# Altium schematic sheet Sheet1.SchDoc
size A
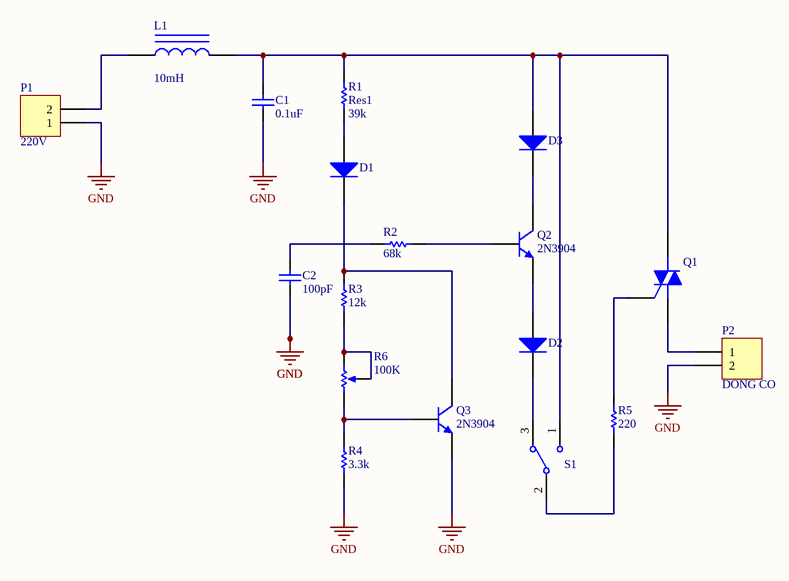
[diagram p0: Sheet1.SchDoc]

## Parts
C1  value 0.1uF  [CAPR2.54-5.1x3.2]  (hidden comment: Cap)
C2  value 100pF  [CAPR2.54-5.1x3.2]  (hidden comment: Cap)
D1  Diode  [AXIAL-0.3]  (value not drawn)
D2  Diode  [AXIAL-0.3]  (value not drawn)
D3  Diode  [AXIAL-0.3]  (value not drawn)
L1  value 10mH  [AXIAL-0.9]  (hidden comment: Inductor Iron)
P1  220V  [HDR1X2]
P2  DONG CO  [HDR1X2]
Q1  Triac  [SFM-T3/A2.4V]  (value not drawn)
Q2  2N3904  [SFM-T3/X1.6V]
Q3  2N3904  [SFM-T3/X1.6V]
R1  Res1  value 39k  [AXIAL-0.3]
R2  value 68k  [AXIAL-0.3]  (hidden comment: Res1)
R3  value 12k  [AXIAL-0.3]  (hidden comment: Res1)
R4  value 3.3k  [AXIAL-0.3]  (hidden comment: Res1)
R5  value 220  [AXIAL-0.3]  (hidden comment: Res1)
R6  value 100K  [VR5]  (hidden comment: RPot)
S1  SW-SPDT  [TL36WW15050]  (value not drawn)

## Nets
GND: C1.1 C2.1 P1.1 P2.2 Q3.1(E) R4.1
NetC1_2: C1.2 D3.1(A) L1.2 Q1.2(M2) R1.2 S1.1
NetC2_2: C2.2 R2.1
NetD1_1: D1.1(A) R1.1
NetD1_2: D1.2(K) Q3.3(C) R3.2
NetD2_1: D2.1(A) Q2.1(E)
NetD2_2: D2.2(K) S1.3
NetD3_2: D3.2(K) Q2.3(C)
NetL1_1: L1.1 P1.2
NetP2_1: P2.1 Q1.1(M1)
NetQ1_3: Q1.3(G) R5.2
NetQ2_2: Q2.2(B) R2.2
NetQ3_2: Q3.2(B) R4.2 R6.1(TOP)
NetR3_1: R3.1 R6.2(BOT) R6.3(TAP)
NetR5_1: R5.1 S1.2

## Library data of the parts
C1 C2 = Cap: Capacitor; Published: 8-Jun-2000; LatestRevisionDate: 17-Jul-2002; LatestRevisionNote: Re-released for DXP Platform.; PackageReference: RAD-0.3; Publisher: Altium Limited
D1-D3 = Diode: Default Diode; Published: 8-Jun-2000; LatestRevisionDate: 17-Jul-2002; LatestRevisionNote: Re-released for DXP Platform.; PackageVersion: Sep-1996; PackageReference: SMC; Publisher: Altium Limited; Code_JEDEC: DO-214-AB
L1 = Inductor Iron: Magnetic-Core Inductor; Published: 24-Mar-1999; LatestRevisionDate: 17-Jul-2002; LatestRevisionNote: Re-released for DXP Platform.; PackageReference: AXIAL-0.9; Publisher: Altium Limited
P1 P2 = Header 2: Header, 2-Pin; LatestRevisionDate: 17-Jul-2002; LatestRevisionNote: Re-released for DXP Platform.; Publisher: Altium Limited
Q1 = Triac: Silicon Bidirectional Triode Thyristor; Note: Pin 2 is electrically connected to Pin 4 (TAB); Published: 29-Sep-2000; LatestRevisionDate: 17-Jul-2002; LatestRevisionNote: Re-released for DXP Platform.; DatasheetVersion: 1999; PackageReference: 369-03; Publisher: Altium Limited; Code_JEDEC: TO-251-AA; ComponentLink1Description: Manufacturer Link; ComponentLink1URL: http://www.motorola.com/
Q2 Q3 = 2N3904: NPN General Purpose Amplifier; Published: 8-Jun-2000; LatestRevisionDate: 15-Jan-2003; LatestRevisionNote: PCB Footprint 'BCY-W3/D4.7' replaced; DatasheetVersion: 1997; PackageVersion: Sep-1998; PackageReference: TO-92A; Publisher: Altium Limited; Code_JEDEC: TO-92A; ComponentLink1Description: Manufacturer Link; ComponentLink1URL: http://www.fairchildsemi.com/; ComponentLink2Description: Datasheet; ComponentLink2URL: http://www.fairchildsemi.com/ds/2N%2F2N3904.pdf
R1-R5 = Res1: Resistor; Published: 8-Jun-2000; LatestRevisionDate: 17-Jul-2002; LatestRevisionNote: Re-released for DXP Platform.; PackageReference: AXIAL-0.3; Publisher: Altium Limited
R6 = RPot: Potentiometer; Sim Note: Enter the Resistance value and the set point into parameter fields.; Set Position: 0.5; Published: 8-Jun-2000; LatestRevisionDate: 17-Jul-2002; LatestRevisionNote: Re-released for DXP Platform.; PackageReference: VR5; Publisher: Altium Limited
S1 = SW-SPDT: SPDT Subminiature Toggle Switch, Right Angle Mounting, Vertical Actuation; Published: 24-Mar-1999; LatestRevisionDate: 17-Dec-2003; LatestRevisionNote: Schematic revised, PCB Footprint replaced.; DatasheetVersion: 05-Dec-2000; PackageReference: TL36WW15050; Publisher: Altium Limited; ComponentLink1Description: Manufacturer Link; ComponentLink1URL: http://www.apem.com